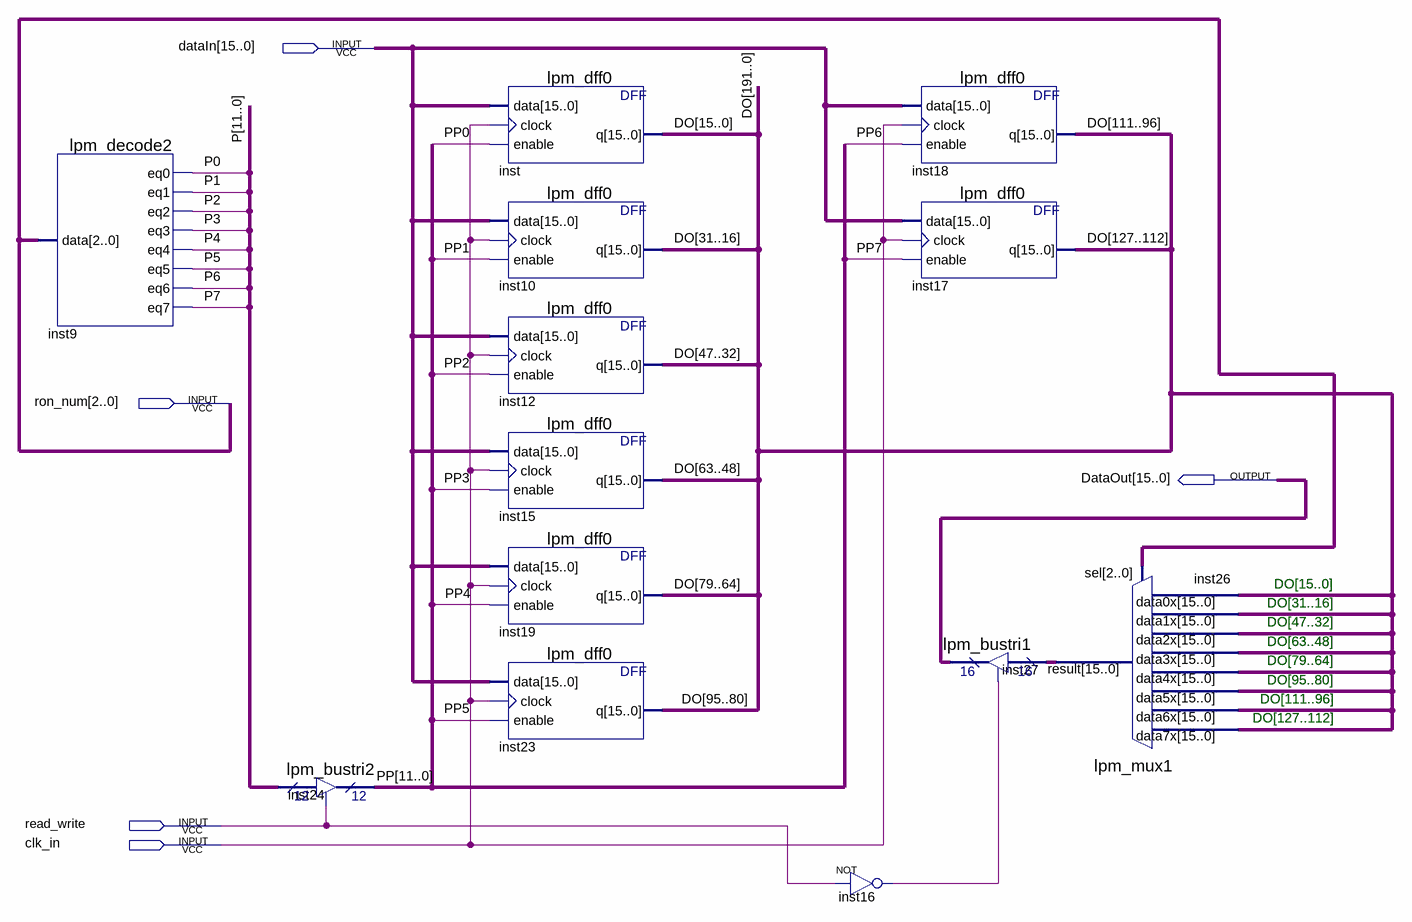
[diagram p0: schematic sheet]
// Quartus schematic RONs.bdf as structural Verilog: 13 symbols, 5 pins
module RONs (
  input  [15:0] dataIn,
  input  [2:0] ron_num,
  input  read_write,
  input  clk_in,
  output [15:0] DataOut
);

  wire inst16_out;
  wire [11:0] P, PP;
  wire [15:0] inst26_result;
  wire [127:0] DO;

  lpm_decode2 inst9 (
    .data(ron_num), .eq0(P[0]), .eq1(P[1]), .eq2(P[2]), .eq3(P[3]), .eq4(P[4]), .eq5(P[5]), .eq6(P[6]),
    .eq7(P[7]));
  lpm_bustri2 inst24 (.enabledt(read_write), .data(P), .tridata(PP));
  lpm_dff0 inst (.data(dataIn), .clock(clk_in), .enable(PP[0]), .q(DO[15:0]));
  lpm_dff0 inst10 (.data(dataIn), .clock(clk_in), .enable(PP[1]), .q(DO[31:16]));
  lpm_dff0 inst12 (.data(dataIn), .clock(clk_in), .enable(PP[2]), .q(DO[47:32]));
  lpm_dff0 inst15 (.data(dataIn), .clock(clk_in), .enable(PP[3]), .q(DO[63:48]));
  lpm_dff0 inst19 (.data(dataIn), .clock(clk_in), .enable(PP[4]), .q(DO[79:64]));
  lpm_dff0 inst23 (.data(dataIn), .clock(clk_in), .enable(PP[5]), .q(DO[95:80]));
  lpm_dff0 inst18 (.data(dataIn), .clock(clk_in), .enable(PP[6]), .q(DO[111:96]));
  lpm_dff0 inst17 (.data(dataIn), .clock(clk_in), .enable(PP[7]), .q(DO[127:112]));
  not inst16 (inst16_out, read_write);
  lpm_bustri1 inst27 (.enabledt(inst16_out), .data(inst26_result), .tridata(DataOut));
  lpm_mux1 inst26 (
    .data7x(DO[127:112]), .data6x(DO[111:96]), .data5x(DO[95:80]), .data4x(DO[79:64]), .data3x(DO[63:48]),
    .data2x(DO[47:32]), .data1x(DO[31:16]), .data0x(DO[15:0]), .sel(ron_num), .result(inst26_result));

  // Notes on the sheet:
  //   DO[15..0]
  //   DO[31..16]
  //   DO[47..32]
  //   DO[63..48]
  //   DO[79..64]
  //   DO[95..80]
  //   DO[111..96]
  //   DO[127..112]
endmodule
